# EAGLE design LNA_inductor (EAGLE 6.5.0)
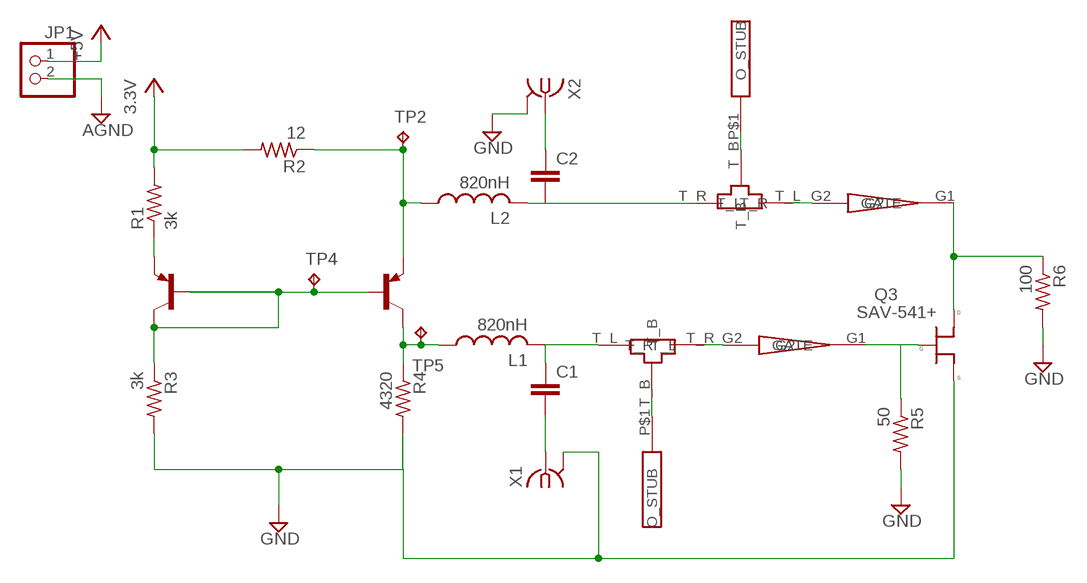
[diagram p0: schematic, sheet 1]

## Parts
C1  C-EUC0603  [C0603]
C2  C-EUC0603  [C0603]
JP1  PINHD-1X2  [1X02]
L1  820nH  L-USL3225M  [L3225M]
L2  820nH  L-USL3225M  [L3225M]
Q1  MMBT3906LT1SMD  [SOT23-BEC]
Q2  MMBT3906LT1SMD  [SOT23-BEC]
Q3  SAV-541+  [SOT-343]
R1  3k  R-US_M1206  [M1206]
R2  12  R-US_M1206  [M1206]
R3  3k  R-US_M1206  [M1206]
R4  4320  R-US_M1206  [M1206]
R5  50  R-US_M1206  [M1206]
R6  100  R-US_M1206  [M1206]
TP2  TPB1,27  [B1,27]
TP4  TPB1,27  [B1,27]
TP5  TPB1,27  [B1,27]
U$1  TAPPERED_TL1  [TAPPERED_TL1]
U$2  TEE_TL1  [TEE_TL1]
U$3  OPEN_STUB1  [OPEN_STUB1]
U$4  TAPPERED_TL1  [TAPPERED_TL1]
U$5  TEE_TL1  [TEE_TL1]
U$6  OPEN_STUB1  [OPEN_STUB1]
X1  SMA-142-0701-871/876  [J502-ND-142-0701-871/876]
X2  SMA-142-0701-871/876  [J502-ND-142-0701-871/876]

## Nets
+3.3V: JP1.1 R1.2 R2.2 ; supply symbol labelled +5V, 3.3V
GND: JP1.2 Q3.2(S) Q3.4(S) R3.2 R4.2 R5.2 R6.2 X1.G@1 X1.G@2 X1.G@3 X1.G@4 X2.G@1 X2.G@2 X2.G@3 X2.G@4 ; supply symbol labelled AGND
N$1: Q1.B Q1.C Q2.B R3.1 TP4.TP
N$2: L1.1 Q2.C R4.1 TP5.TP
N$3: Q3.3(G) R5.1 U$1.G1(GATE)
N$4: Q1.E R1.1
N$5: U$1.G2 U$2.T_R
N$6: L2.1 Q2.E R2.1 TP2.TP
N$7: C1.1 L1.2 U$2.T_L
N$8: U$2.T_B U$3.P$1(O_STUB)
N$9: C1.2 X1.1
N$10: C2.2 L2.2 U$5.T_R
N$11: C2.1 X2.1
N$12: Q3.1(D) R6.1 U$4.G1(GATE)
N$14: U$5.T_B U$6.P$1(O_STUB)
N$15: U$4.G2 U$5.T_L

## Library data of the parts
C1 C2 = rcl:C-EU: CAPACITOR, European symbol
JP1 = pinhead:PINHD-1X2: PIN HEADER
L1 L2 = resistor:L-US: INDUCTOR, American symbol
Q1 Q2 = transistor-pnp:MMBT3906*: PNP Transistror
Q3 = ECE532_Parts:SAV-541+
R1-R6 = rcl:R-US_: RESISTOR, American symbol
TP2 TP4 TP5 = testpad:TP: Test pad
U$1 U$4 = ECE532_Parts:TAPPERED_TL1
U$2 U$5 = ECE532_Parts:TEE_TL1
U$3 U$6 = ECE532_Parts:OPEN_STUB1
X1 X2 = con-coax:SMA-: SMA 50 Ohm End Launch Jack Receptacle - Round Contact Johnson Components Source: www.johnsoncomponents.com .. J502-ND.pdf; MF: JOHNSON COMPONENTS; MPN: 142-0701-871; OC_FARNELL: 1339835; OC_NEWARK: 91B6105

## Board
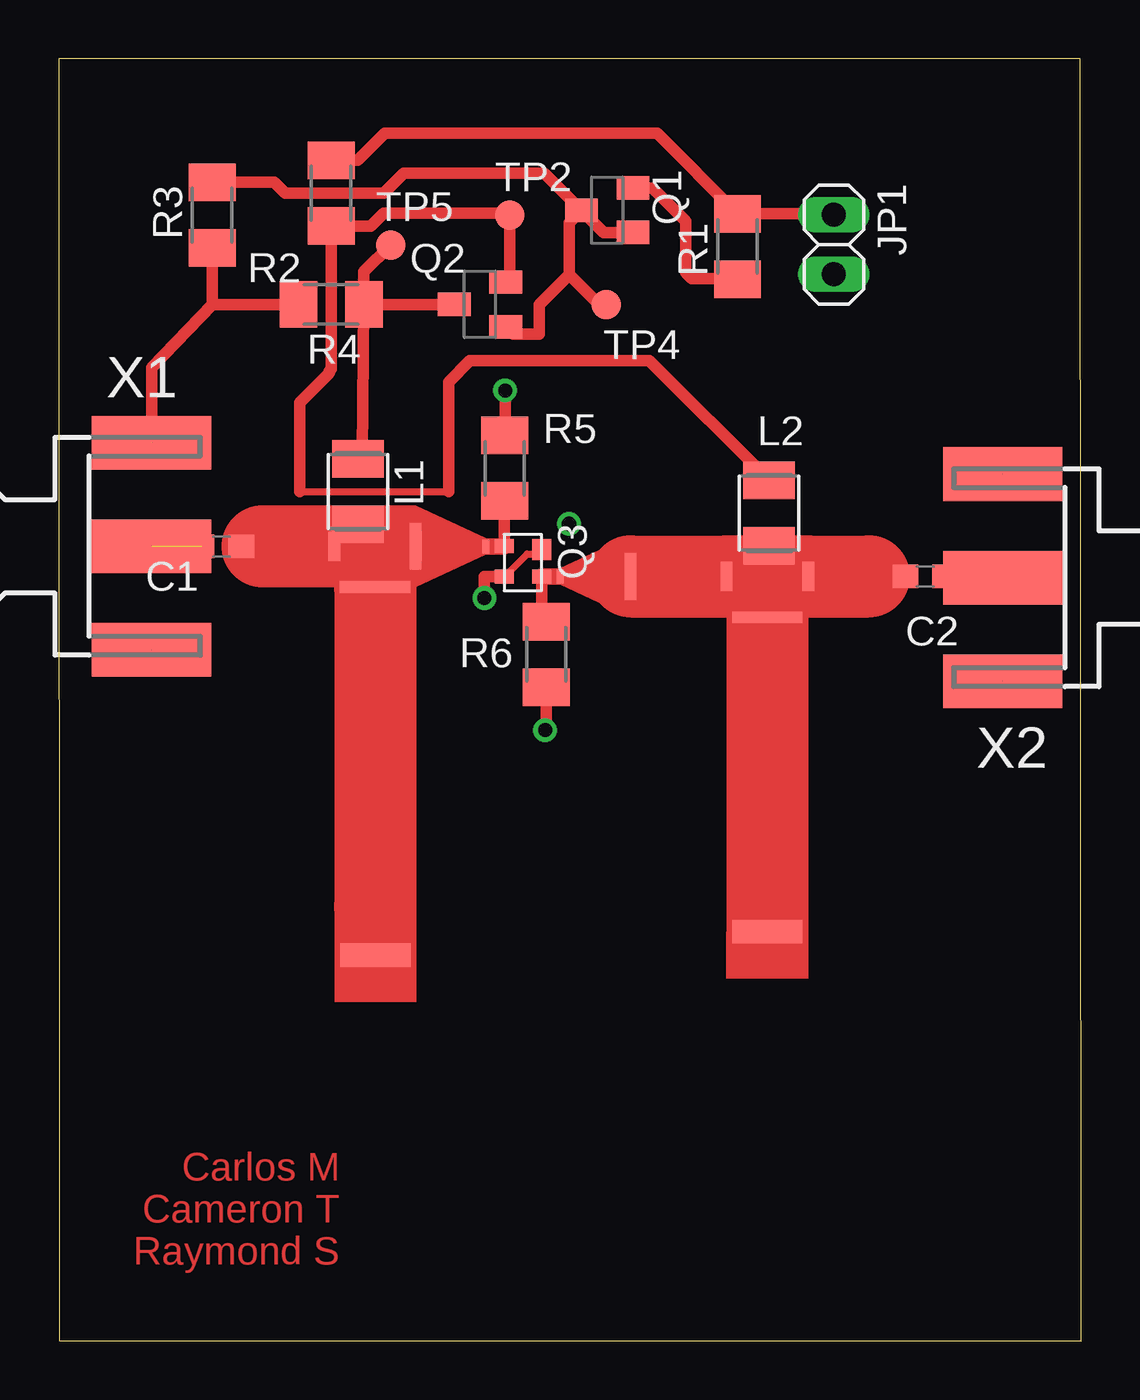
[diagram p1: board, top side]
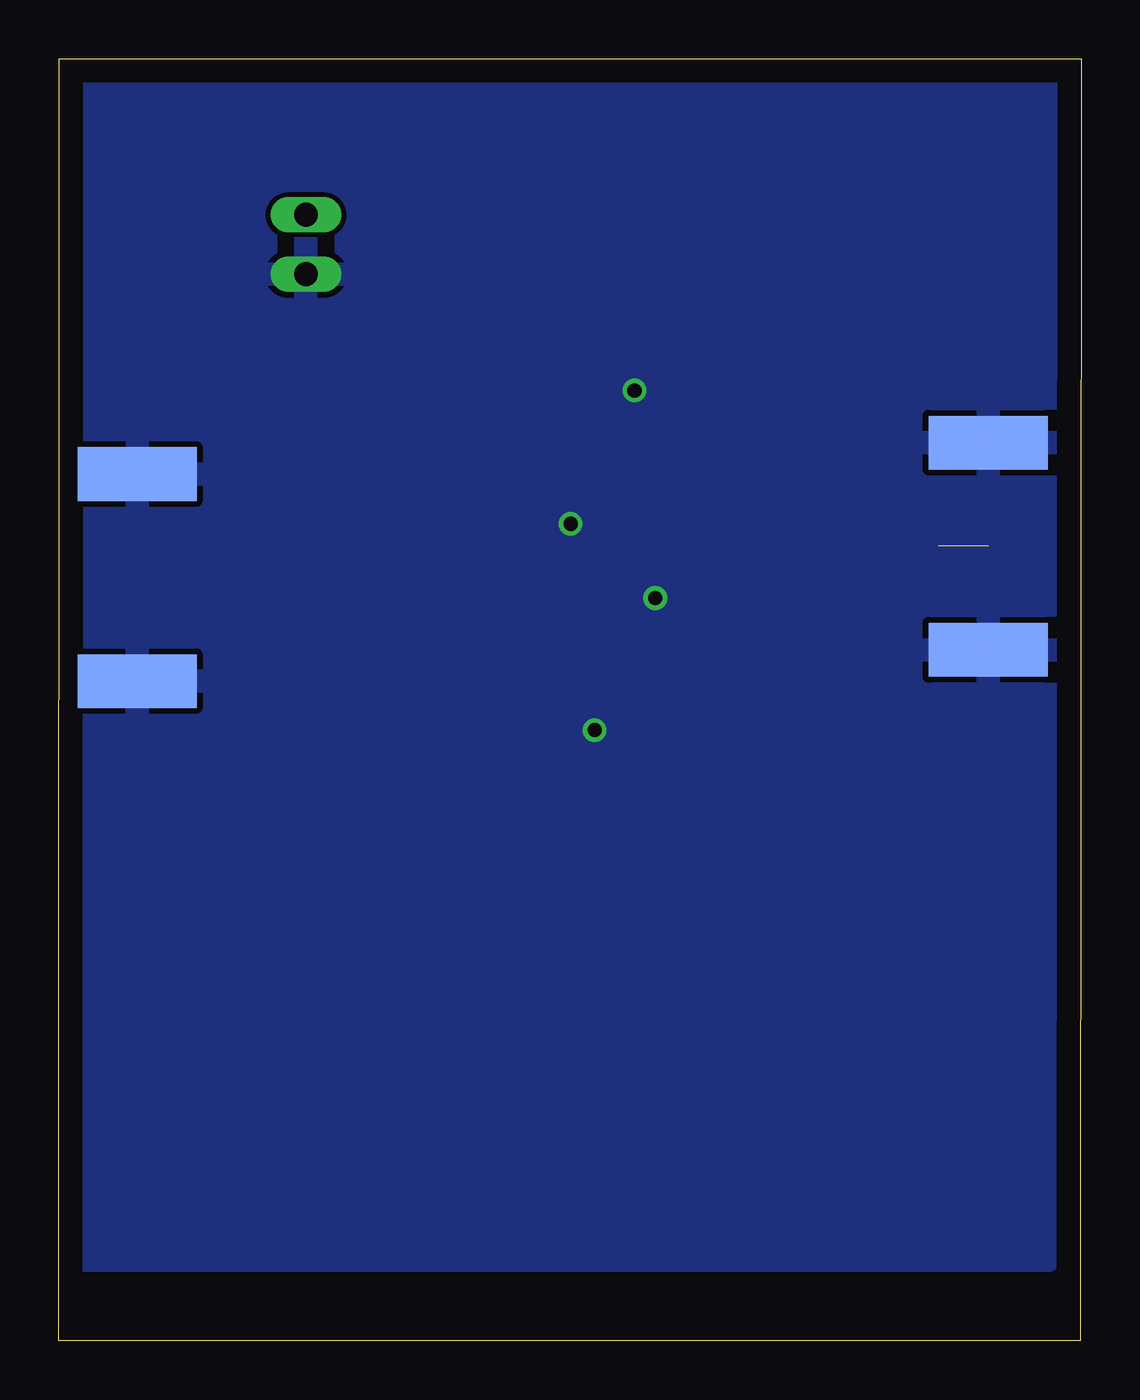
[diagram p2: board, bottom side, seen from below]

Size 43.64 x 54.74 mm. Coordinates in mm from the lower left corner, seen from the top.
Outline: 0.04,0 43.64,0 43.6,54.74 0,54.74 0.04,0
Copper layers (1*16): Top 0.035mm / dielectric 1.5mm / Bottom 0.035mm
Design rules "default": minimum track width 10mil, minimum drill 24mil, track to track 8mil, track to pad 8mil, pad to pad 8mil, via to via 8mil, smd to smd 8mil, copper to edge 40mil, drill to drill 8mil, minimum pad ring 10mil, minimum via ring 8mil, stop-mask expansion 4mil, vias tented up to drill 0mil, thermal gap 10mil

### Footprints (pad centres in the part's own frame; a part is rotated, then mirrored left to right if it is on the bottom)
C0603 = smd 1.1 x 1: 1 -0.85,0; 2 0.85,0
1X02 = drill 1.016 long: 1 -1.27,0; 2 1.27,0
L3225M = smd 1.6 x 2.2: 1 -1.4,0; 2 1.4,0
SOT23-BEC = smd 1 x 1.4: B -0.95,-1.1; C 0,1.1; E 0.95,-1.1
SOT-343 = smd 0.6 x 0.8: 1 1.3,1.6; 3 0,0; 4 1.3,0 | smd 0.9 x 0.8: 2 0.15,1.6
M1206 = smd 1.6 x 2: 1 -1.4,0; 2 1.4,0
B1,27 = smd 1.27 x 1.27: TP 0,0
TAPPERED_TL1 = smd 0.6 x 0.3: G1 0,-3.08 | smd 2 x 0.5: G2 0,-0.08
TEE_TL1 = smd 3 x 0.5: T_B 0,-0.475 | smd 0.5 x 1.27: T_L -1.745,1.27; T_R 1.745,1.27
OPEN_STUB1 = smd 3 x 1: P$1 0,0
J502-ND-142-0701-871/876 = smd 5.08 x 2.286: 1 2.565,0; G@1 2.565,4.42; G@2 2.565,-4.42 | smd 5.08 x 2.286 bottom: G@3 2.565,4.42; G@4 2.565,-4.42

### Placement (x,y rotation side)
C1  6.95,33.92 180 top
C2  36.99,32.64 180 top
JP1  33.08,46.81 270 top
L1  12.78,36.26 270 top
L2  30.32,35.34 270 top
Q1  23.41,48.27 90 top
Q2  17.98,44.25 90 top
Q3  19.02,33.93 270 top
R1  28.97,46.72 90 top
R2  11.63,49 90 top
R3  6.55,48.06 270 top
R4  11.63,44.25 180 top
R5  19.04,37.26 90 top
R6  20.81,29.3 270 top
TP2  19.25,48.06 0 top
TP4  23.37,44.24 0 top
TP5  14.17,46.79 0 top
U$1  15.15,33.92 90 top
U$2  13.51,32.66 0 top
U$3  13.52,16.46 0 top
U$4  24.49,32.64 270 top
U$5  30.24,31.37 0 top
U$6  30.24,17.47 0 top
X1  1.4,33.92 0 top
X2  42.85,32.59 180 top

### Tracks (layer width: path | path; a pad name or v marks a point on that pad's centre or on a via)
+3.3V
  Top 0.5: R2.2 12.77,50.4 13.92,51.55 25.54,51.55 R1.2 33.04,48.12 JP1.1
GND  (via drill 0.6)  (4 unrouted)
  Top 0.3: Q3.4 19.04,32.63 20,33.59 20.43,33.59 Q3.2
  Top 0.5: R4.2 6.55,44.25 | 6.55,44.25 3.96,41.54 X1.G@3 | R3.2 6.55,44.25 | R5.2 19.06,38.66 v19.06,40.58 | Q3.4 18.17,32.63 v18.17,31.71 | v20.76,26.08 20.81,26.08 R6.2
  other vias: 21.78,34.88
  pour Bottom: 58.8,3.44 58.8,88.4 1.4,89.8 1.4,3.44
N$1
  Top 0.5: 21.79,45.52 20.52,44.25 20.52,42.98 19.4,42.98 Q2.B | 21.79,45.52 21.79,47.75 Q1.C | TP4.TP 23.07,44.24 21.79,45.52 | Q1.B 23.26,47.32 Q1.C | R3.1 9.21,49.46 9.67,49 13.32,49 13.87,49 14.72,49.85 20.73,49.85 Q1.C
N$2
  Top 0.5: 12.96,37.86 R4.1 | R4.1 Q2.C | R4.1 13.03,45.65 TP5.TP
  Top 1: L1.1 12.96,37.86
N$3
  Top 0.5: Q3.3 19.02,36.03 R5.1
  Top 0.7: U$1.G1 19,33.92 Q3.3
N$4
  Top 0.5: Q1.E 25.35,49.22 26.77,47.8 26.77,45.6 27.02,45.35 28.94,45.35 R1.1
N$5
  Top 1: U$1.G2 U$2.T_R
N$6
  Top 0.3: 10.29,36.26 16.64,36.26
  Top 0.5: Q2.E 19.25,45.2 TP2.TP 19.16,48.15 13.87,48.15 13.32,47.6 R2.1 11.63,42.98 11.63,42.97 11.63,41.48 11.55,41.41 11.55,41.31 10.29,40.05 10.29,36.26 | 16.64,36.26 16.64,40.94 17.56,41.85 25.21,41.85 L2.1
N$7
  Top 1: C1.1 8.7,33.92 | U$2.T_L 11.84,33.92 L1.2
  Top 3.49: 8.7,33.92 11.7,33.92 U$2.T_L
N$8
  Top 3.49: U$2.T_B 13.51,18.55 U$3.P$1
N$9  (1 unrouted)
N$10
  Top 0.5: L2.2 30.32,32.64 U$5.T_R | 34.58,32.65 36.14,32.65 C2.2
  Top 3.49: U$5.T_R 34.58,32.64 34.58,32.65
N$11
  Top 0.5: C2.1 40.28,32.64 X2.1
N$12
  Top 0.5: Q3.1 20.61,30.8 R6.1
  Top 0.7: U$4.G1 Q3.1
N$13
  pour Top: 8.78,34.61 8.85,34.61 8.85,34.94
N$14
  Top 3.49: U$5.T_B U$6.P$1
N$15
  Top 3.49: U$4.G2 U$5.T_L

### Text on the board
Top: Carlos M / Cameron T / Raymond S